# EAGLE schematic buildsbot-12-ounce (EAGLE 6.0)
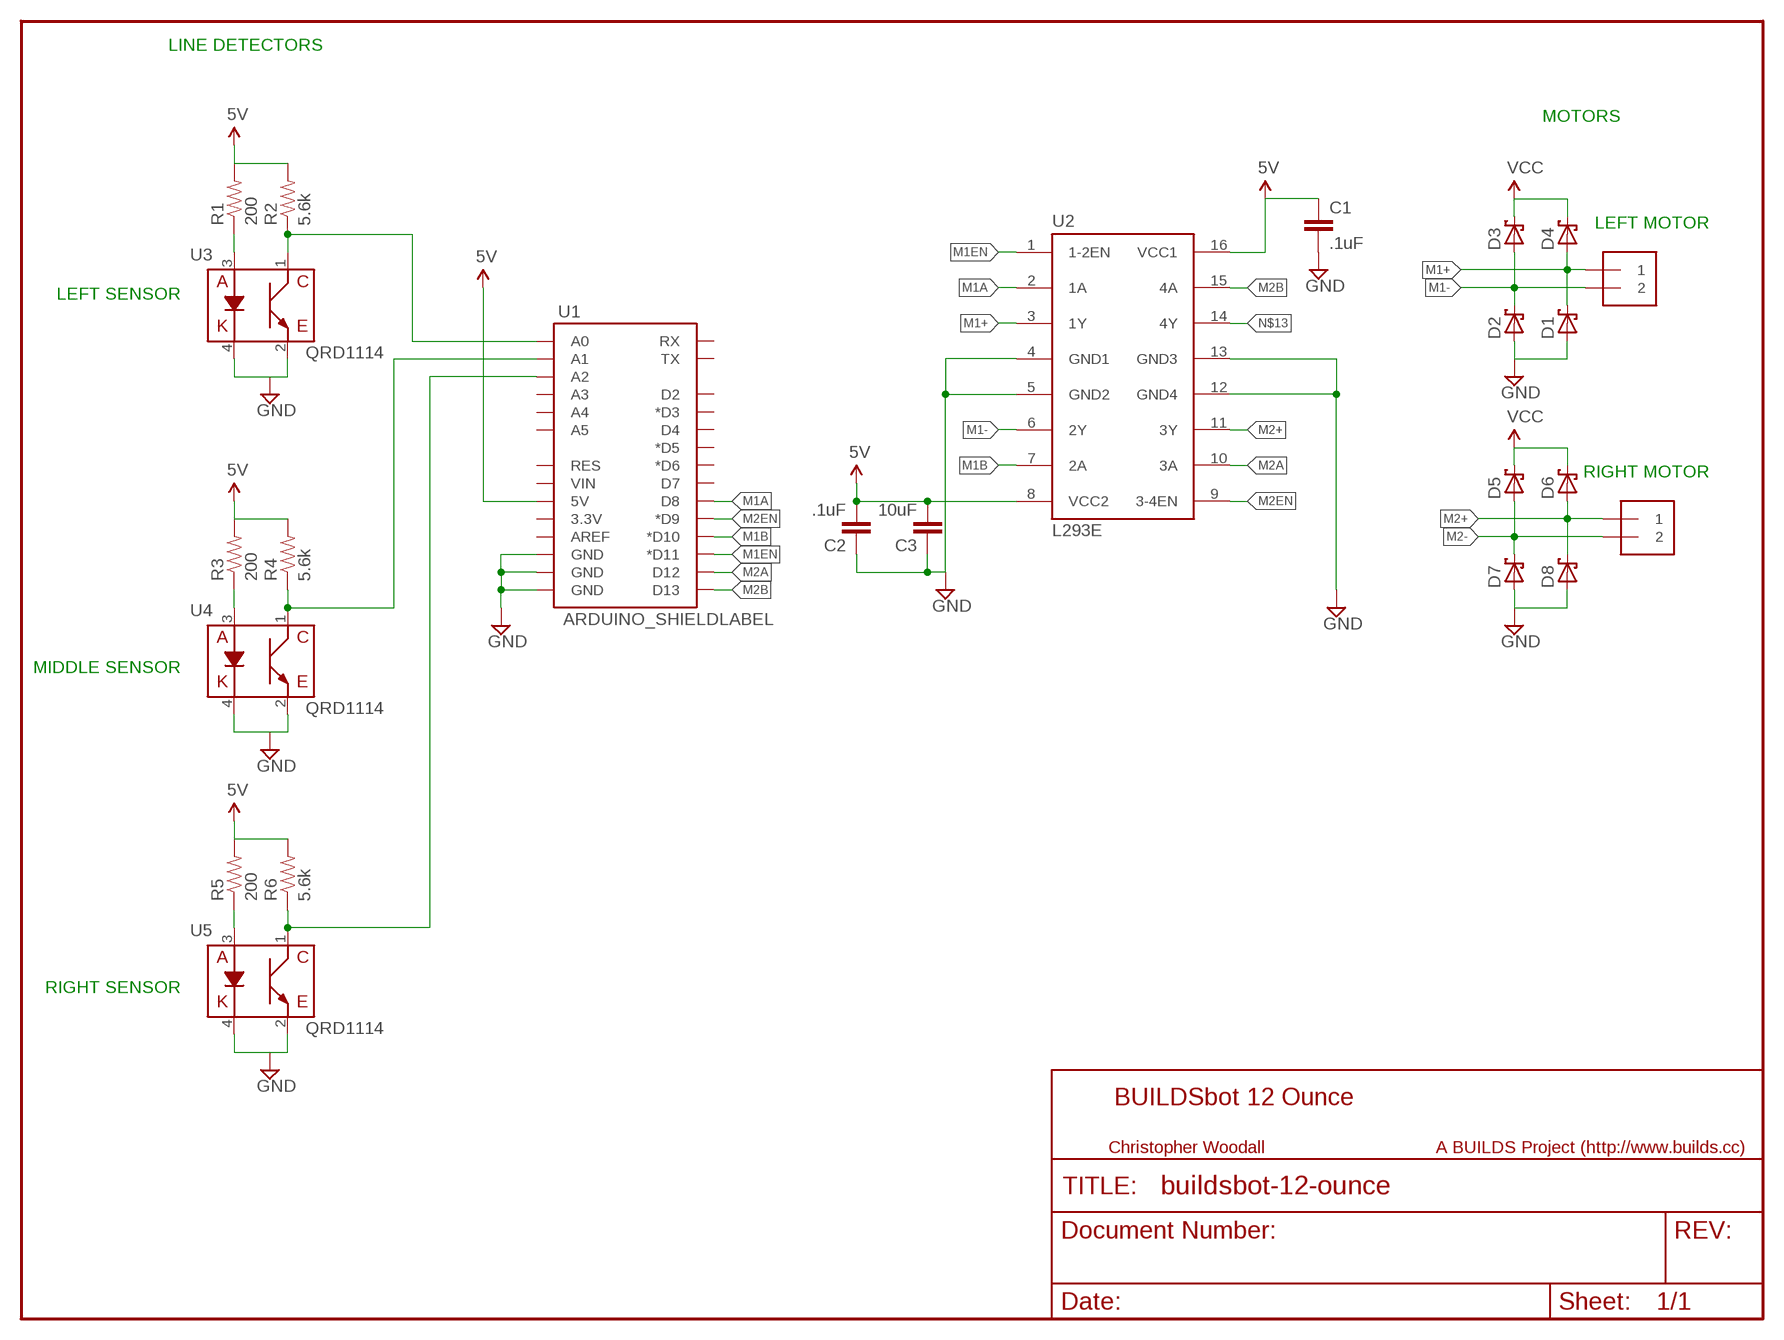
[diagram p0: schematic, sheet 1]

## Parts
C1  .1uF  CAPPTH2  [CAP-PTH-SMALL2]
C2  .1uF  CAPPTH2  [CAP-PTH-SMALL2]
C3  10uF  CAPPTH2  [CAP-PTH-SMALL2]
D1  SCHOTTKY-DIODEC4111-15  [C4111-15]
D2  SCHOTTKY-DIODEC4111-15  [C4111-15]
D3  SCHOTTKY-DIODEC4111-15  [C4111-15]
D4  SCHOTTKY-DIODEC4111-15  [C4111-15]
D5  SCHOTTKY-DIODEC4111-15  [C4111-15]
D6  SCHOTTKY-DIODEC4111-15  [C4111-15]
D7  SCHOTTKY-DIODEC4111-15  [C4111-15]
D8  SCHOTTKY-DIODEC4111-15  [C4111-15]
J1  1X2-3.5MM  [1X2-3.5MM]
J2  1X2-3.5MM  [1X2-3.5MM]
R1  200  RESISTORPTH-1/4W  [AXIAL-0.4]
R2  5.6k  RESISTORPTH-1/4W  [AXIAL-0.4]
R3  200  RESISTORPTH-1/4W  [AXIAL-0.4]
R4  5.6k  RESISTORPTH-1/4W  [AXIAL-0.4]
R5  200  RESISTORPTH-1/4W  [AXIAL-0.4]
R6  5.6k  RESISTORPTH-1/4W  [AXIAL-0.4]
U1  ARDUINO_SHIELDLABEL  [DUEMILANOVE_SHIELD]
U2  L293E  [DIL16]
U3  QRD1114  [QRD1114]
U4  QRD1114  [QRD1114]
U5  QRD1114  [QRD1114]

## Nets
GND: D1.A D2.A D7.A D8.A U1.GND@0(GND) U1.GND@1(GND) U1.GND@2(GND) U3.2(C) U3.4(K) U4.2(C) U4.4(K) U5.2(C) U5.4(K)
M1+: D1.C D4.A J1.1 U2.3(1Y)
M1-: D2.C D3.A J1.2 U2.6(2Y)
M1A: U1.D8 U2.2(1A)
M1B: U1.D10(*D10) U2.7(2A)
M1EN: U1.D11(*D11) U2.1(1-2EN)
M2+: D6.A D8.C J2.1 U2.11(3Y)
M2-: C1.2 C2.1 C3.1 D5.A D7.C J2.2 U2.4(GND1) U2.5(GND2) U2.12(GND4) U2.13(GND3) ; supply symbol labelled GND
M2A: U1.D12 U2.10(3A)
M2B: U1.D13 U2.15(4A)
M2EN: U1.D9(*D9) U2.9(3-4EN)
N$4: R2.P$1 U1.A0 U3.1(E)
N$5: R1.P$1 U3.3(A)
N$6: R4.P$1 U1.A1 U4.1(E)
N$7: R3.P$1 U4.3(A)
N$8: R6.P$1 U1.A2 U5.1(E)
N$9: R5.P$1 U5.3(A)
N$13: U2.14(4Y)
VCC: C1.1 C2.2 C3.2 D3.C D4.C D5.C D6.C R1.P$2 R2.P$2 R3.P$2 R4.P$2 R5.P$2 R6.P$2 U1.5V U2.8(VCC2) U2.16(VCC1) ; supply symbol labelled 5V
Unconnected: U1.3.3V U1.A3 U1.A4 U1.A5 U1.AREF U1.D2 U1.D3(*D3) U1.D4 U1.D5(*D5) U1.D6(*D6) U1.D7 U1.RES U1.RX U1.TX U1.VIN

## Notes on the sheet
- LINE DETECTORS
- MOTORS
- LEFT MOTOR
- LEFT SENSOR
- RIGHT MOTOR
- MIDDLE SENSOR
- RIGHT SENSOR
- BUILDSbot 12 Ounce
- Christopher Woodall | A BUILDS Project (http://www.builds.cc)

## Library data of the parts
C1-C3 = SparkFun:CAP: Capacitor Standard 0603 ceramic capacitor, and 0.1" leaded capacitor.
D1-D8 = adafruit:SCHOTTKY-DIODE: Schottky Diode
J1 J2 = adafruit:1X2: 3.5mm Terminal block http://www.ladyada.net/library/pcb/eaglelibrary.html
R1-R6 = SparkFun:RESISTOR: Resistor Basic schematic elements and footprints for 0603, 1206, and PTH resistors.
U1 = SparkFun:ARDUINO_SHIELD
U2 = texas:L293E: TI DEVICE; MF: Arrow Electronics; MPN: L293E; OC_FARNELL: 1467711; OC_NEWARK: 89K0732
U3-U5 = SparkFun:QRD1114